# Altium schematic sheet VoltageRegulator_3v3.SchDoc
size A; SheetNumber: 6; SheetTotal: 10
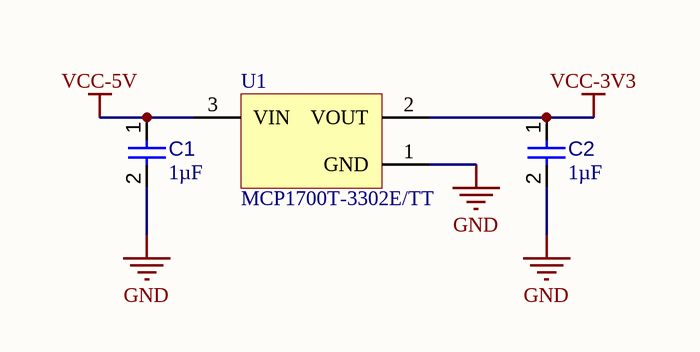
[diagram p0: VoltageRegulator_3v3.SchDoc]

## Parts
C1  value 1µF  [CAPC0603(1608)100_L]  (hidden comment: Capacitor 1µF +/-40% 50V 0603)
C2  value 1µF  [CAPC0603(1608)100_L]  (hidden comment: Capacitor 1µF +/-40% 50V 0603)
U1  MCP1700T-3302E/TT  [SOT-23-TT3_N]

## Nets
GND: C1.2 C2.2 U1.1(GND)
VCC-3V3: C2.1 U1.2(VOUT)
VCC-5V: C1.1 U1.3(VIN)

## Library data of the parts
C1 C2 = CMP-001-00078-4: Chip Capacitor, 1µF +/-40%, 50V, 0603, Thickness 1 mm; Tolerance: 10%; Min Operating Temperature: -55°C; Max Operating Temperature: 85°C; Case/Package: 0603; Voltage Rating: 50V; Pins: 2; Mounting Technology: SMT
U1 = CMP-0136-00791-1: Low Quiescent Current LDO, 3-Pin SOT-23, Extended Temperature, Tape and Reel; PackageVersion: revBB, Aug-2009; Code_IPC: SOT23-3; PackageReference: SOT-23-TT3; DatasheetVersion: revB, Feb-2007; PackageDescription: 3-Lead Plastic Small Outline Transistor (TT) [SOT-23]